# Altium schematic sheet RZ120.SchDoc
size A4; Organization: Altium Limited; Address1: L3, 12a Rodborough Rd; Address2: Frenchs Forest; Address3: NSW; Address4: Australia 2086
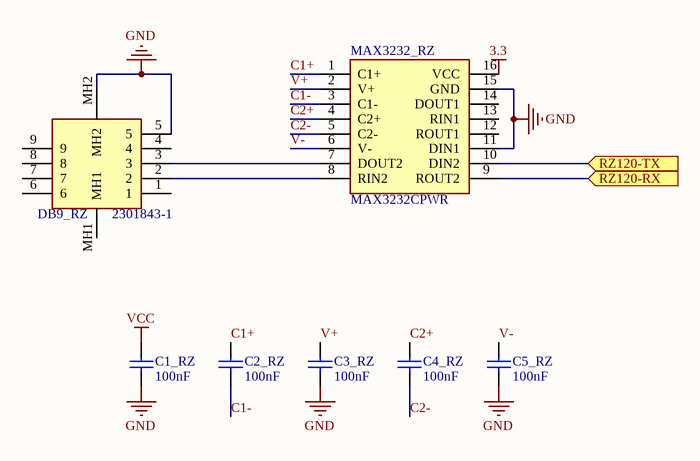
[diagram p0: RZ120.SchDoc]

## Parts
C1_RZ  value 100nF  [1608[0603]]  (hidden comment: Cap Semi)
C2_RZ  value 100nF  [1608[0603]]  (hidden comment: Cap Semi)
C3_RZ  value 100nF  [1608[0603]]  (hidden comment: Cap Semi)
C4_RZ  value 100nF  [1608[0603]]  (hidden comment: Cap Semi)
C5_RZ  value 100nF  [1608[0603]]  (hidden comment: Cap Semi)
DB9_RZ  2301843-1  [23018431]
MAX3232_RZ  MAX3232CPWR  [SOP65P640X120-16N]

## Ports
RZ120-RX, RZ120-TX

## Nets
3.3: MAX3232_RZ.16(VCC)
GND: C1_RZ.1 C3_RZ.1 C5_RZ.1 DB9_RZ.5 DB9_RZ.MH2 MAX3232_RZ.11(DIN1) MAX3232_RZ.15(GND)
VCC: C1_RZ.2
C1+: C2_RZ.2 MAX3232_RZ.1(C1+)
C1-: C2_RZ.1 MAX3232_RZ.3(C1-)
C2+: C4_RZ.2 MAX3232_RZ.4(C2+)
C2-: C4_RZ.1 MAX3232_RZ.5(C2-)
RZ120-RX: MAX3232_RZ.9(ROUT2) ; port RZ120-RX
RZ120-TX: MAX3232_RZ.10(DIN2) ; port RZ120-TX
V+: C3_RZ.2 MAX3232_RZ.2(V+)
V-: C5_RZ.2 MAX3232_RZ.6(V-)
NetDB9_RZ_2: DB9_RZ.2 MAX3232_RZ.8(RIN2)
NetDB9_RZ_3: DB9_RZ.3 MAX3232_RZ.7(DOUT2)

Not connected (* = marked no-connect by the designer): DB9_RZ 1 4 6 7 8 9 MH1; MAX3232_RZ 12(ROUT1) 13(RIN1) 14(DOUT1)

## Notes on the sheet
- Title
- Size:
- Date:
- A4
- Number:
- Time:
- Revision:
- Sheet
- of
- File:

## Library data of the parts
C1_RZ C2_RZ C3_RZ C4_RZ C5_RZ = Cap Semi: Capacitor (Semiconductor SIM Model); Published: 8-Jun-2000; LatestRevisionDate: 29-May-2009; LatestRevisionNote: IPC-7351 Footprint Added.; PackageReference: C1206; Publisher: Altium Limited; PackageDescription: Chip Capacitor
DB9_RZ = 2301843-1: Connector; Manufacturer_Name: TE Connectivity; Datasheet Link: https://componentsearchengine.com/Datasheets/2/2301843-1.pdf; Height: 13.955mm; Manufacturer_Part_Number: 2301843-1; Mouser Part Number: 571-2301843-1; Mouser Price/Stock: https://www.mouser.com/Search/Refine.aspx?Keyword=571-2301843-1
MAX3232_RZ = MAX3232CPWR: Integrated Circuit; Manufacturer_Name: Texas Instruments; Datasheet Link: http://www.ti.com/lit/gpn/max3232; Height: 1.2mm; Manufacturer_Part_Number: MAX3232CPWR; Mouser Part Number: 595-MAX3232CPWR; Mouser Price/Stock: https://www.mouser.com/Search/Refine.aspx?Keyword=595-MAX3232CPWR